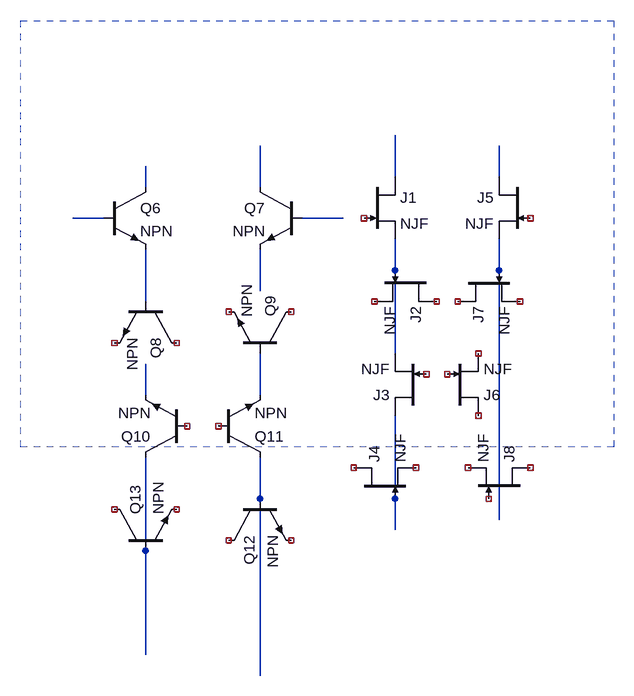
[diagram p0: schematic Cables.asc]
Cables.asc, the LTspice schematic file:
Version 4
SHEET 1 2724 2420
WIRE 576 240 576 176
WIRE 736 240 736 192
WIRE 192 256 192 224
WIRE 368 256 368 192
WIRE 128 304 80 304
WIRE 496 304 432 304
WIRE 576 384 576 336
WIRE 736 384 736 336
WIRE 368 416 368 352
WIRE 192 432 192 352
WIRE 576 512 576 384
WIRE 192 576 192 528
WIRE 368 576 368 512
WIRE 368 736 368 672
WIRE 576 736 576 608
WIRE 736 768 736 384
WIRE 576 784 576 736
WIRE 192 816 192 672
WIRE 192 976 192 816
WIRE 368 1008 368 736
SYMBOL npn 128 256 R0
SYMATTR InstName Q6
SYMBOL npn 432 256 M0
SYMATTR InstName Q7
SYMBOL npn 240 432 R90
SYMATTR InstName Q8
SYMBOL npn 416 512 M270
SYMATTR InstName Q9
SYMBOL npn 256 672 R180
SYMATTR InstName Q10
SYMBOL npn 304 672 M180
SYMATTR InstName Q11
SYMBOL npn 320 736 M90
SYMATTR InstName Q12
SYMBOL npn 144 816 R270
SYMATTR InstName Q13
SYMBOL njf 528 240 R0
SYMATTR InstName J1
SYMBOL njf 640 384 R90
SYMATTR InstName J2
SYMBOL njf 624 608 R180
SYMATTR InstName J3
SYMBOL njf 512 736 R270
SYMATTR InstName J4
SYMBOL njf 784 240 M0
SYMATTR InstName J5
SYMBOL njf 656 608 M180
SYMATTR InstName J6
SYMBOL njf 672 384 M90
SYMATTR InstName J7
SYMBOL njf 784 736 M270
SYMATTR InstName J8
RECTANGLE Normal 912 656 0 0 2

The netlist it stands for:
* Cables.asc
Q6 N003 N005 N010 0 NPN
Q7 N004 N006 N009 0 NPN
Q8 NC_01 N010 NC_02 0 NPN
Q9 NC_03 N012 NC_04 0 NPN
Q10 N015 NC_05 N011 0 NPN
Q11 N013 NC_06 N012 0 NPN
Q12 NC_07 N013 NC_08 0 NPN
Q13 NC_09 N015 NC_10 0 NPN
J1 N001 NC_11 N007 NJF
J2 NC_12 N007 NC_13 NJF
J3 N014 NC_14 N007 NJF
J4 NC_15 N014 NC_16 NJF
J5 N002 NC_17 N008 NJF
J6 NC_18 NC_19 NC_20 NJF
J7 NC_21 N008 NC_22 NJF
J8 NC_23 NC_24 NC_25 NJF
.model NPN NPN
.model PNP PNP
.lib standard.bjt
.model NJF NJF
.model PJF PJF
.lib standard.jft
.backanno
.end